# Altium project Smart-light.PrjPcb
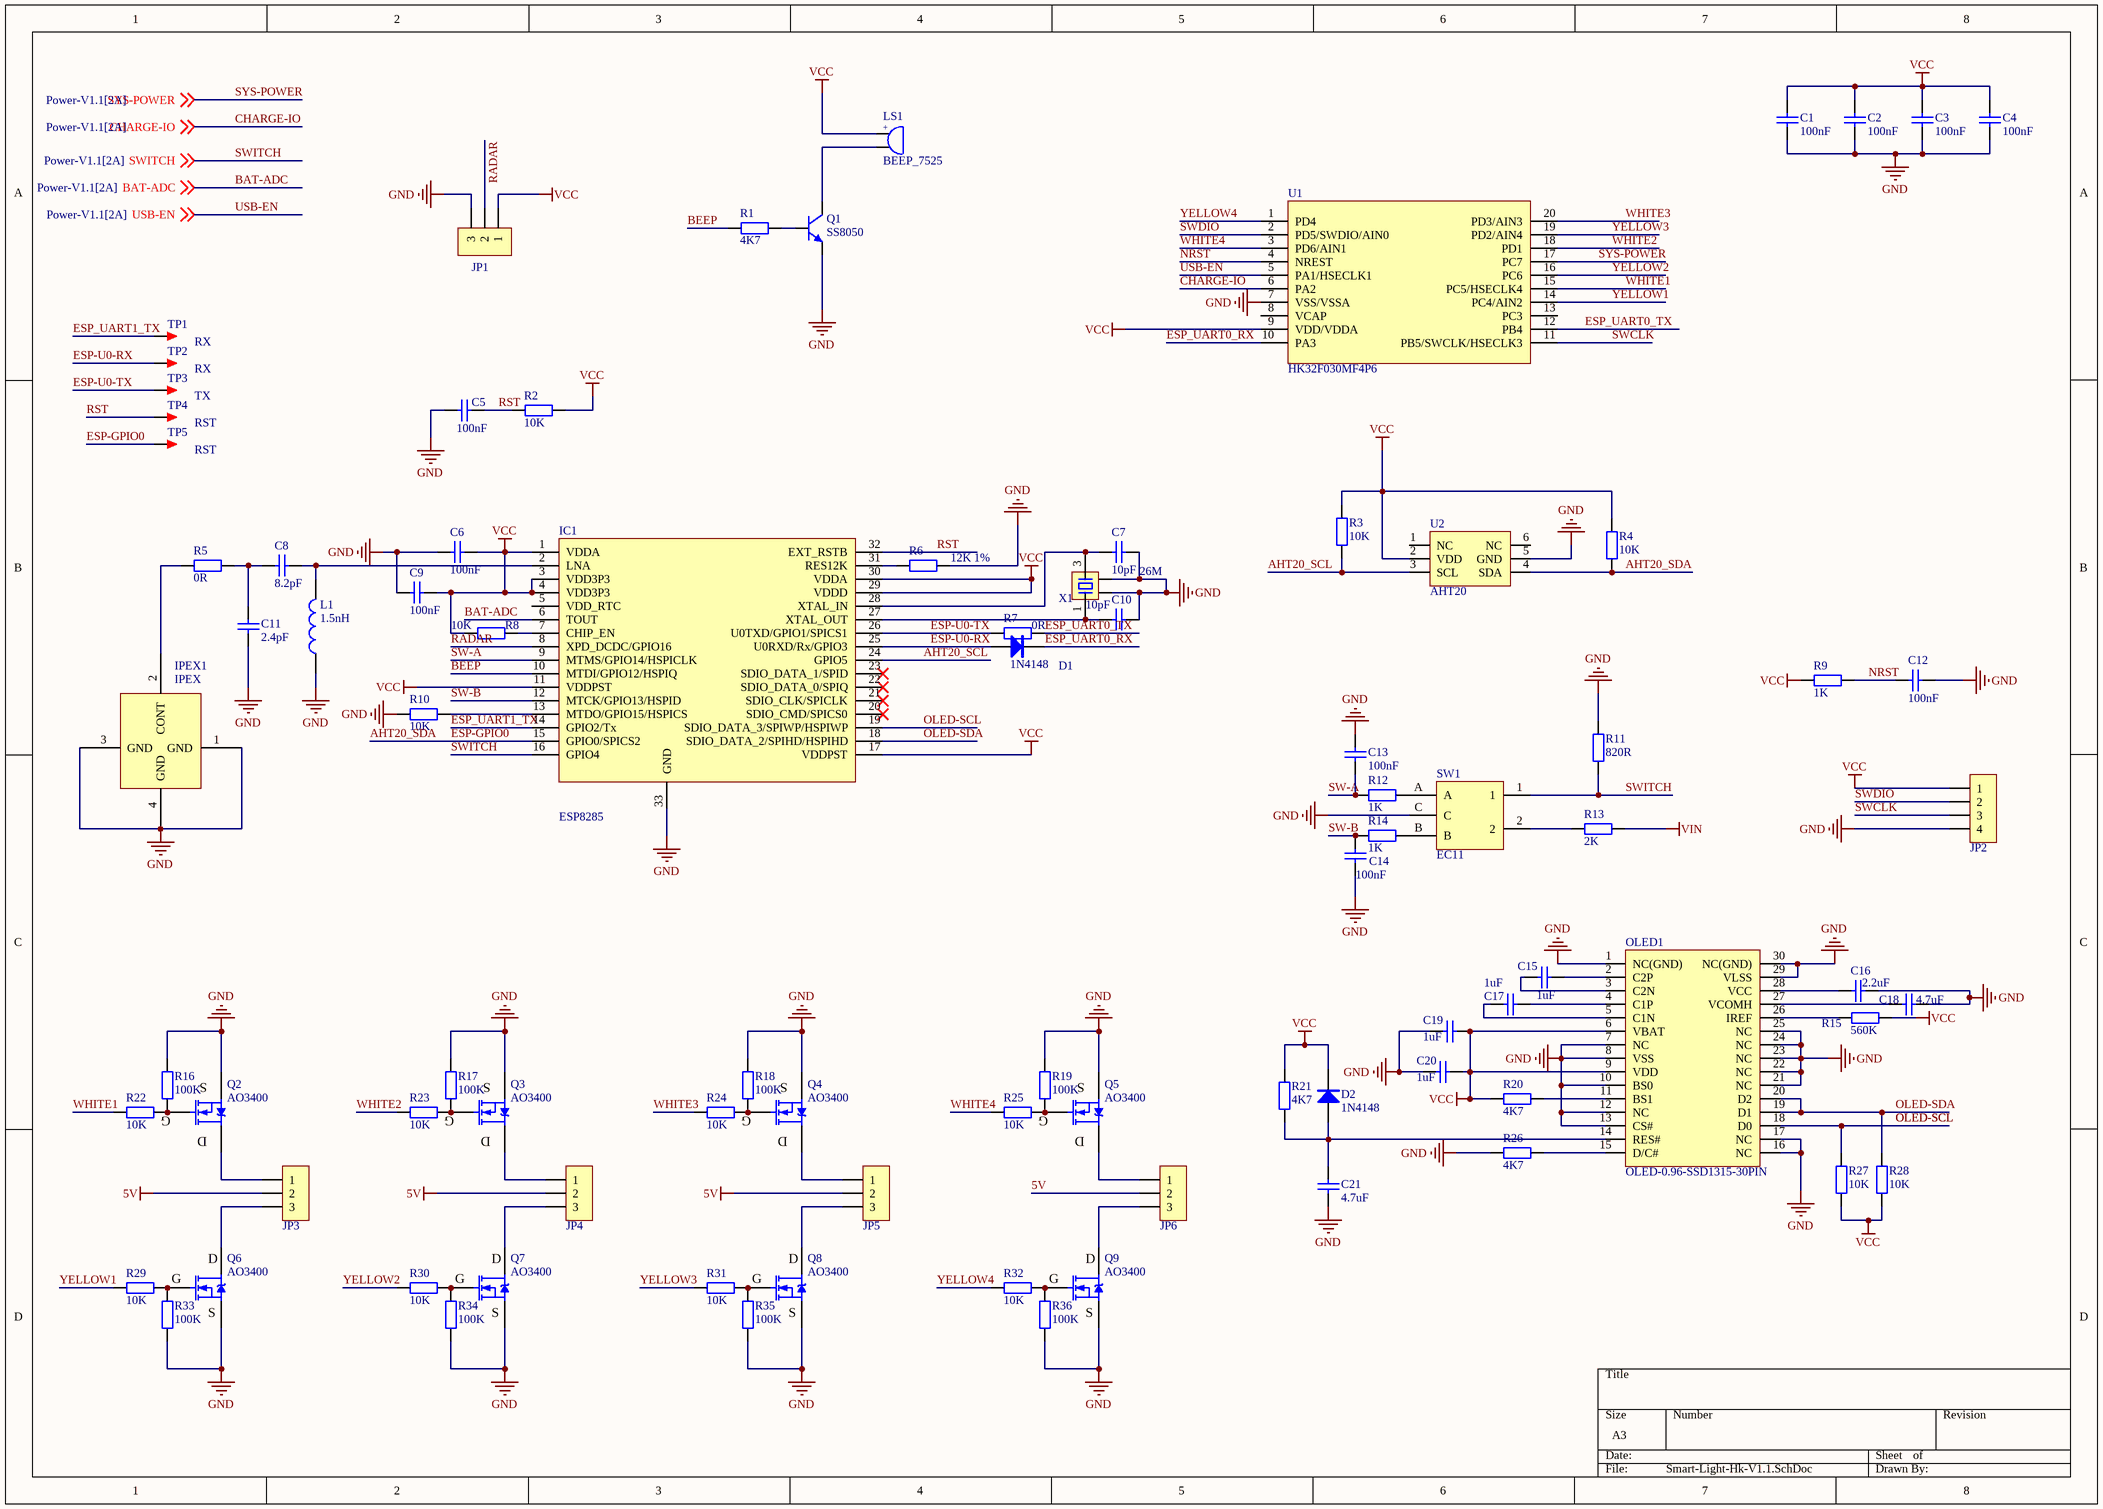
[diagram p0: Smart-Light-Hk-V1.1.SchDoc]
2 sheets, 137 parts. Net scope: global (net labels, ports and power ports of the same name join across sheets).
Board file: Smart-Light-Modulator-V1.1.PcbDoc
Sheets:
  Smart-Light-Hk-V1.1.SchDoc
  Power-V1.1.SchDoc

## Sheet Smart-Light-Hk-V1.1.SchDoc
size A3; SheetNumber: 1; SheetTotal: 2

### Parts
C1  100nF  [C0603_M]
C2  100nF  [C0603_M]
C3  100nF  [C0603_M]
C4  100nF  [C0603_M]
C5  100nF  [C0603_M]
C6  100nF  [C0603_M]
C7  10pF  [C0603_M]
C8  8.2pF  [C0603_M]
C9  100nF  [C0603_M]
C10  10pF  [C0603_M]
C11  2.4pF  [C0603_M]
C12  100nF  [C0603_M]
C13  100nF  [C0603_M]
C14  100nF  [C0603_M]
C15  1uF  [C0603_M]
C16  2.2uF  [C0603_M]
C17  1uF  [C0603_M]
C18  4.7uF  [C0603_M]
C19  1uF  [C0603_M]
C20  1uF  [C0603_M]
C21  4.7uF  [C0603_M]
D1  1N4148  [SOD-123]
D2  1N4148  [SOD-123]
IC1  ESP8285  [QFN32 5x5_N]
IPEX1  IPEX  [IPEX1_SMD]
JP1  HDR-1X3  [HDR2.54-WI-3P]  (value not drawn)
JP2  HDR-1X4  [HDR2.54-LI-4P]  (value not drawn)
JP3  HDR-1X3  [XH2.54-WI-3P]  (value not drawn)
JP4  HDR-1X3  [XH2.54-WI-3P]  (value not drawn)
JP5  HDR-1X3  [XH2.54-WI-3P]  (value not drawn)
JP6  HDR-1X3  [XH2.54-WI-3P]  (value not drawn)
L1  1.5nH  [L0603]
LS1  BEEP_7525  [BEEP 7525]
OLED1  OLED-0.96-SSD1315-30PIN  [SSD1306-30Pin]
Q1  SS8050  [SOT23-3N]
Q2  AO3400  [SOT23-3N]
Q3  AO3400  [SOT23-3N]
Q4  AO3400  [SOT23-3N]
Q5  AO3400  [SOT23-3N]
Q6  AO3400  [SOT23-3N]
Q7  AO3400  [SOT23-3N]
Q8  AO3400  [SOT23-3N]
Q9  AO3400  [SOT23-3N]
R1  4K7  [R0603_M]
R2  10K  [R0603_M]
R3  10K  [R0603_M]
R4  10K  [R0603_M]
R5  0R  [R0603_M]
R6  12K 1%  [R0603_M]
R7  0R  [R0603_M]
R8  10K  [R0603_M]
R9  1K  [R0603_M]
R10  10K  [R0603_M]
R11  820R  [R0603_M]
R12  1K  [R0603_M]
R13  2K  [R0603_M]
R14  1K  [R0603_M]
R15  560K  [R0603_M]
R16  100K  [R0603_M]
R17  100K  [R0603_M]
R18  100K  [R0603_M]
R19  100K  [R0603_M]
R20  4K7  [R0603_M]
R21  4K7  [R0603_M]
R22  10K  [R0603_M]
R23  10K  [R0603_M]
R24  10K  [R0603_M]
R25  10K  [R0603_M]
R26  4K7  [R0603_M]
R27  10K  [R0603_M]
R28  10K  [R0603_M]
R29  10K  [R0603_M]
R30  10K  [R0603_M]
R31  10K  [R0603_M]
R32  10K  [R0603_M]
R33  100K  [R0603_M]
R34  100K  [R0603_M]
R35  100K  [R0603_M]
R36  100K  [R0603_M]
SW1  EC11  [EC11-B]
TP1  RX  [TEST 1.6]
TP2  RX  [TEST 1.6]
TP3  TX  [TEST 1.6]
TP4  RST  [TEST 1.6]
TP5  RST  [TEST 1.6]
U1  HK32F030MF4P6  [TSSOP-20]
U2  AHT20  [AHT20]
X1  26M  [XTAL-3225-4P]

### Nets
5V: JP3.2 JP4.2 JP5.2 JP6.2
GND: C1.1 C2.1 C3.1 C4.1 C5.1 C6.1 C7.1 C9.1 C10.1 C11.1 C12.2 C13.2 C14.1 C16.2 C18.2 C19.1 C20.1 C21.2 IC1.33(GND) IPEX1.1(GND) IPEX1.3(GND) IPEX1.4(GND) JP1.3 JP2.4 L1.1 OLED1.1(NC(GND)) OLED1.7(NC) OLED1.8(VSS) OLED1.10(BS0) OLED1.12(NC) OLED1.13(CS#) OLED1.16(NC) OLED1.17(NC) OLED1.21(NC) OLED1.22(NC) OLED1.23(NC) OLED1.24(NC) OLED1.25(NC) OLED1.29(VLSS) OLED1.30(NC(GND)) Q1.2(E) Q2.2(S) Q3.2(S) Q4.2(S) Q5.2(S) Q6.2(S) Q7.2(S) Q8.2(S) Q9.2(S) R6.2 R10.2 R11.1 R16.1 R17.1 R18.1 R19.1 R26.2 R33.1 R34.1 R35.1 R36.1 SW1.C U1.7(VSS/VSSA) U2.5(GND) X1.2 X1.4
VCC: C1.2 C2.2 C3.2 C4.2 C6.2 C9.2 C19.2 C20.2 D2.2(K) IC1.1(VDDA) IC1.3(VDD3P3) IC1.4(VDD3P3) IC1.11(VDDPST) IC1.17(VDDPST) IC1.29(VDDD) IC1.30(VDDA) JP1.1 JP2.1 LS1.1 OLED1.6(VBAT) OLED1.9(VDD) R2.2 R3.2 R4.2 R8.2 R9.1 R15.1 R20.2 R21.1 R27.1 R28.1 U1.9(VDD/VDDA) U2.2(VDD)
VIN: R13.1
AHT20_SCL: IC1.24(GPIO5) R3.1 U2.3(SCL)
AHT20_SDA: IC1.15(GPIO0/SPICS2) R4.1 TP5.1 U2.4(SDA)  [also labelled ESP-GPIO0]
BAT-ADC: IC1.6(TOUT) ; off-sheet BAT-ADC
BEEP: IC1.10(MTDI/GPIO12/HSPIQ) R1.2
CHARGE-IO: U1.6(PA2) ; off-sheet CHARGE-IO
ESP-U0-RX: D1.1(A) IC1.25(U0RXD/Rx/GPIO3) TP2.1
ESP-U0-TX: IC1.26(U0TXD/GPIO1/SPICS1) R7.2 TP3.1
ESP_UART0_RX: D1.2(K) U1.10(PA3)
ESP_UART0_TX: R7.1 U1.12(PB4)
ESP_UART1_TX: IC1.14(GPIO2/Tx) TP1.1
NRST: C12.1 R9.2 U1.4(NREST)
OLED-SCL: IC1.19(SDIO_DATA_3/SPIWP/HSPIWP) OLED1.18(D0) R27.2
OLED-SDA: IC1.18(SDIO_DATA_2/SPIHD/HSPIHD) OLED1.19(D1) OLED1.20(D2) R28.2
RADAR: IC1.8(XPD_DCDC/GPIO16) JP1.2
RST: C5.2 IC1.32(EXT_RSTB) R2.1 TP4.1
SW-A: C13.1 IC1.9(MTMS/GPIO14/HSPICLK) R12.1
SW-B: C14.2 IC1.12(MTCK/GPIO13/HSPID) R14.1
SWCLK: JP2.3 U1.11(PB5/SWCLK/HSECLK3)
SWDIO: JP2.2 U1.2(PD5/SWDIO/AIN0)
SWITCH: IC1.16(GPIO4) R11.2 SW1.1 ; off-sheet SWITCH
SYS-POWER: U1.17(PC7) ; off-sheet SYS-POWER
USB-EN: U1.5(PA1/HSECLK1) ; off-sheet USB-EN
WHITE1: R22.1 U1.15(PC5/HSECLK4)
WHITE2: R23.1 U1.18(PD1)
WHITE3: R24.1 U1.20(PD3/AIN3)
WHITE4: R25.1 U1.3(PD6/AIN1)
YELLOW1: R29.1 U1.14(PC4/AIN2)
YELLOW2: R30.1 U1.16(PC6)
YELLOW3: R31.1 U1.19(PD2/AIN4)
YELLOW4: R32.1 U1.1(PD4)
NetC7_2: C7.2 IC1.28(XTAL_IN) X1.3
NetC8_1: C8.1 IC1.2(LNA) L1.2
NetC8_2: C8.2 C11.2 R5.2
NetC10_2: C10.2 IC1.27(XTAL_OUT) X1.1
NetC15_1: C15.1 OLED1.3(C2N)
NetC15_2: C15.2 OLED1.2(C2P)
NetC16_1: C16.1 OLED1.28(VCC)
NetC17_1: C17.1 OLED1.5(C1N)
NetC17_2: C17.2 OLED1.4(C1P)
NetC18_1: C18.1 OLED1.27(VCOMH)
NetC21_1: C21.1 D2.1(A) OLED1.14(RES#) R21.2
NetIC1_7: IC1.7(CHIP_EN) R8.1
NetIC1_13: IC1.13(MTDO/GPIO15/HSPICS) R10.1
NetIC1_31: IC1.31(RES12K) R6.1
NetIPEX1_2: IPEX1.2(CONT) R5.1
NetJP3_1: JP3.1 Q2.3(D)
NetJP3_3: JP3.3 Q6.3(D)
NetJP4_1: JP4.1 Q3.3(D)
NetJP4_3: JP4.3 Q7.3(D)
NetJP5_1: JP5.1 Q4.3(D)
NetJP5_3: JP5.3 Q8.3(D)
NetJP6_1: JP6.1 Q5.3(D)
NetJP6_3: JP6.3 Q9.3(D)
NetLS1_2: LS1.2 Q1.3(C)
NetOLED1_11: OLED1.11(BS1) R20.1
NetOLED1_15: OLED1.15(D/C#) R26.1
NetOLED1_26: OLED1.26(IREF) R15.2
NetQ1_1: Q1.1(B) R1.1
NetQ2_1: Q2.1(G) R16.2 R22.2
NetQ3_1: Q3.1(G) R17.2 R23.2
NetQ4_1: Q4.1(G) R18.2 R24.2
NetQ5_1: Q5.1(G) R19.2 R25.2
NetQ6_1: Q6.1(G) R29.2 R33.2
NetQ7_1: Q7.1(G) R30.2 R34.2
NetQ8_1: Q8.1(G) R31.2 R35.2
NetQ9_1: Q9.1(G) R32.2 R36.2
NetR12_2: R12.2 SW1.A
NetR13_2: R13.2 SW1.2
NetR14_2: R14.2 SW1.B

Not connected (* = marked no-connect by the designer): IC1 5(VDD_RTC) 20(SDIO_CMD/SPICS0)* 21(SDIO_CLK/SPICLK)* 22(SDIO_DATA_0/SPIQ)* 23(SDIO_DATA_1/SPID)*; LS1 3 4; U1 8(VCAP) 13(PC3); U2 1(NC) 6(NC)

### Notes on the sheet
- (in symbol BEEP_7525) +

### Library data of the parts
C1-C21 = C: 贴片电容/MLCC电容; BOM名称: 无极性贴片电容; 联系下单店铺卖家 免费帮你查找封装: 联系下单店铺卖家 免费技术支持
D1 D2 = 1N4148: 开关二极管; BOM名称: 高速开关二极管; 以赠品形式获赠本封装库的买家，还可联系卖家免费指导AD软件使用: 封装库来自淘宝卖家ID：黄晶宝石
IC1 = ESP8285: WIFI-芯片 内置Flash; 联系下单店铺卖家 免费帮你查找封装: 唯一出售店铺网址https://shop463601444.taobao.com; BOM名称: WIFI-芯片
IPEX1 = IPEX: IPEX天线母座
JP1 JP3-JP6 = Header 3: 3P接插件; 联系卖家，免费查找封装: 唯一出售店铺网址https://shop463601444.taobao.com; 封装库来自淘宝卖家ID：黄晶宝石: 其他店铺购入均为盗版封装库，请立即申请退款，本店现金奖励50~200元; BOM名称: 3P接插件
JP2 = Header 4: 4P接插件; 联系卖家，免费查找封装: 唯一出售店铺网址https://shop463601444.taobao.com; 封装库来自淘宝卖家ID：黄晶宝石: 其他店铺购入均为盗版封装库，请立即申请退款，本店现金奖励50~200元; BOM名称: 4P接插件
L1 = L: 贴片小功率电感; BOM名称: 小功率贴片电感; 联系下单店铺卖家 免费帮你查找封装: 联系下单店铺卖家 免费技术支持
LS1 = BEEP_7525: 无源蜂鸣器侧发声
Q1 = 8050-SMD: 高频放大-NPN型; 参数: 40V 1.5A 1W 100MHZ; 8元以下特价购入的买家: 还可以联系卖家远程指导AD软件使用; BOM名称: 高频放大-NPN型
Q2-Q9 = AO3400: N沟道 30V/4.2A; BOM名称: 场效应管; 8元以下特价购入的买家: 还可以联系卖家远程指导AD软件使用; 参数: N沟道 30V/4.2A
R1-R36 = R: 贴片电阻; 联系下单店铺卖家 免费帮你查找封装: 联系下单店铺卖家 免费技术支持; BOM名称: 贴片电阻
SW1 = EC11: 数字开关编码器; BOM名称: 数字编码开关; 联系卖家，免费查找封装: 唯一出售店铺网址https://shop463601444.taobao.com; 封装库来自淘宝卖家：黄晶宝石: 其他店铺购入均为盗版封装库，请立即申请退款，本店现金奖励200~1000元
TP1-TP5 = TEST: 测试点; 联系卖家，免费查找封装: 唯一出售店铺网址https://shop463601444.taobao.com; 封装库来自淘宝卖家：黄晶宝石: 其他店铺购入均为盗版封装库，请立即申请退款，本店现金奖励200~1000元; BOM名称: 测试点
U1 = HK32F030MF4P6: HK32F030M 系列使用 ARM® CortexTM-M0 内核，最高工作频率 32MHz，内置 16K-Byte / FLASH、448-Byte EEPROM 和 2-KByte SRAM。通过 FLASH 控制器的寄存器配置，可实 / 现中断向量在 16K-Byte 空间内的重映射。
U2 = AHT20: IIC接口 温湿度传感器
X1 = XTAL-4P: 4脚无源晶振(谐振器）; 联系下单店铺卖家 免费帮你查找封装: 联系下单店铺卖家 免费技术支持; BOM名称: 4脚无源晶振(谐振器）

## Sheet Power-V1.1.SchDoc
size A3; SheetNumber: 2; SheetTotal: 2
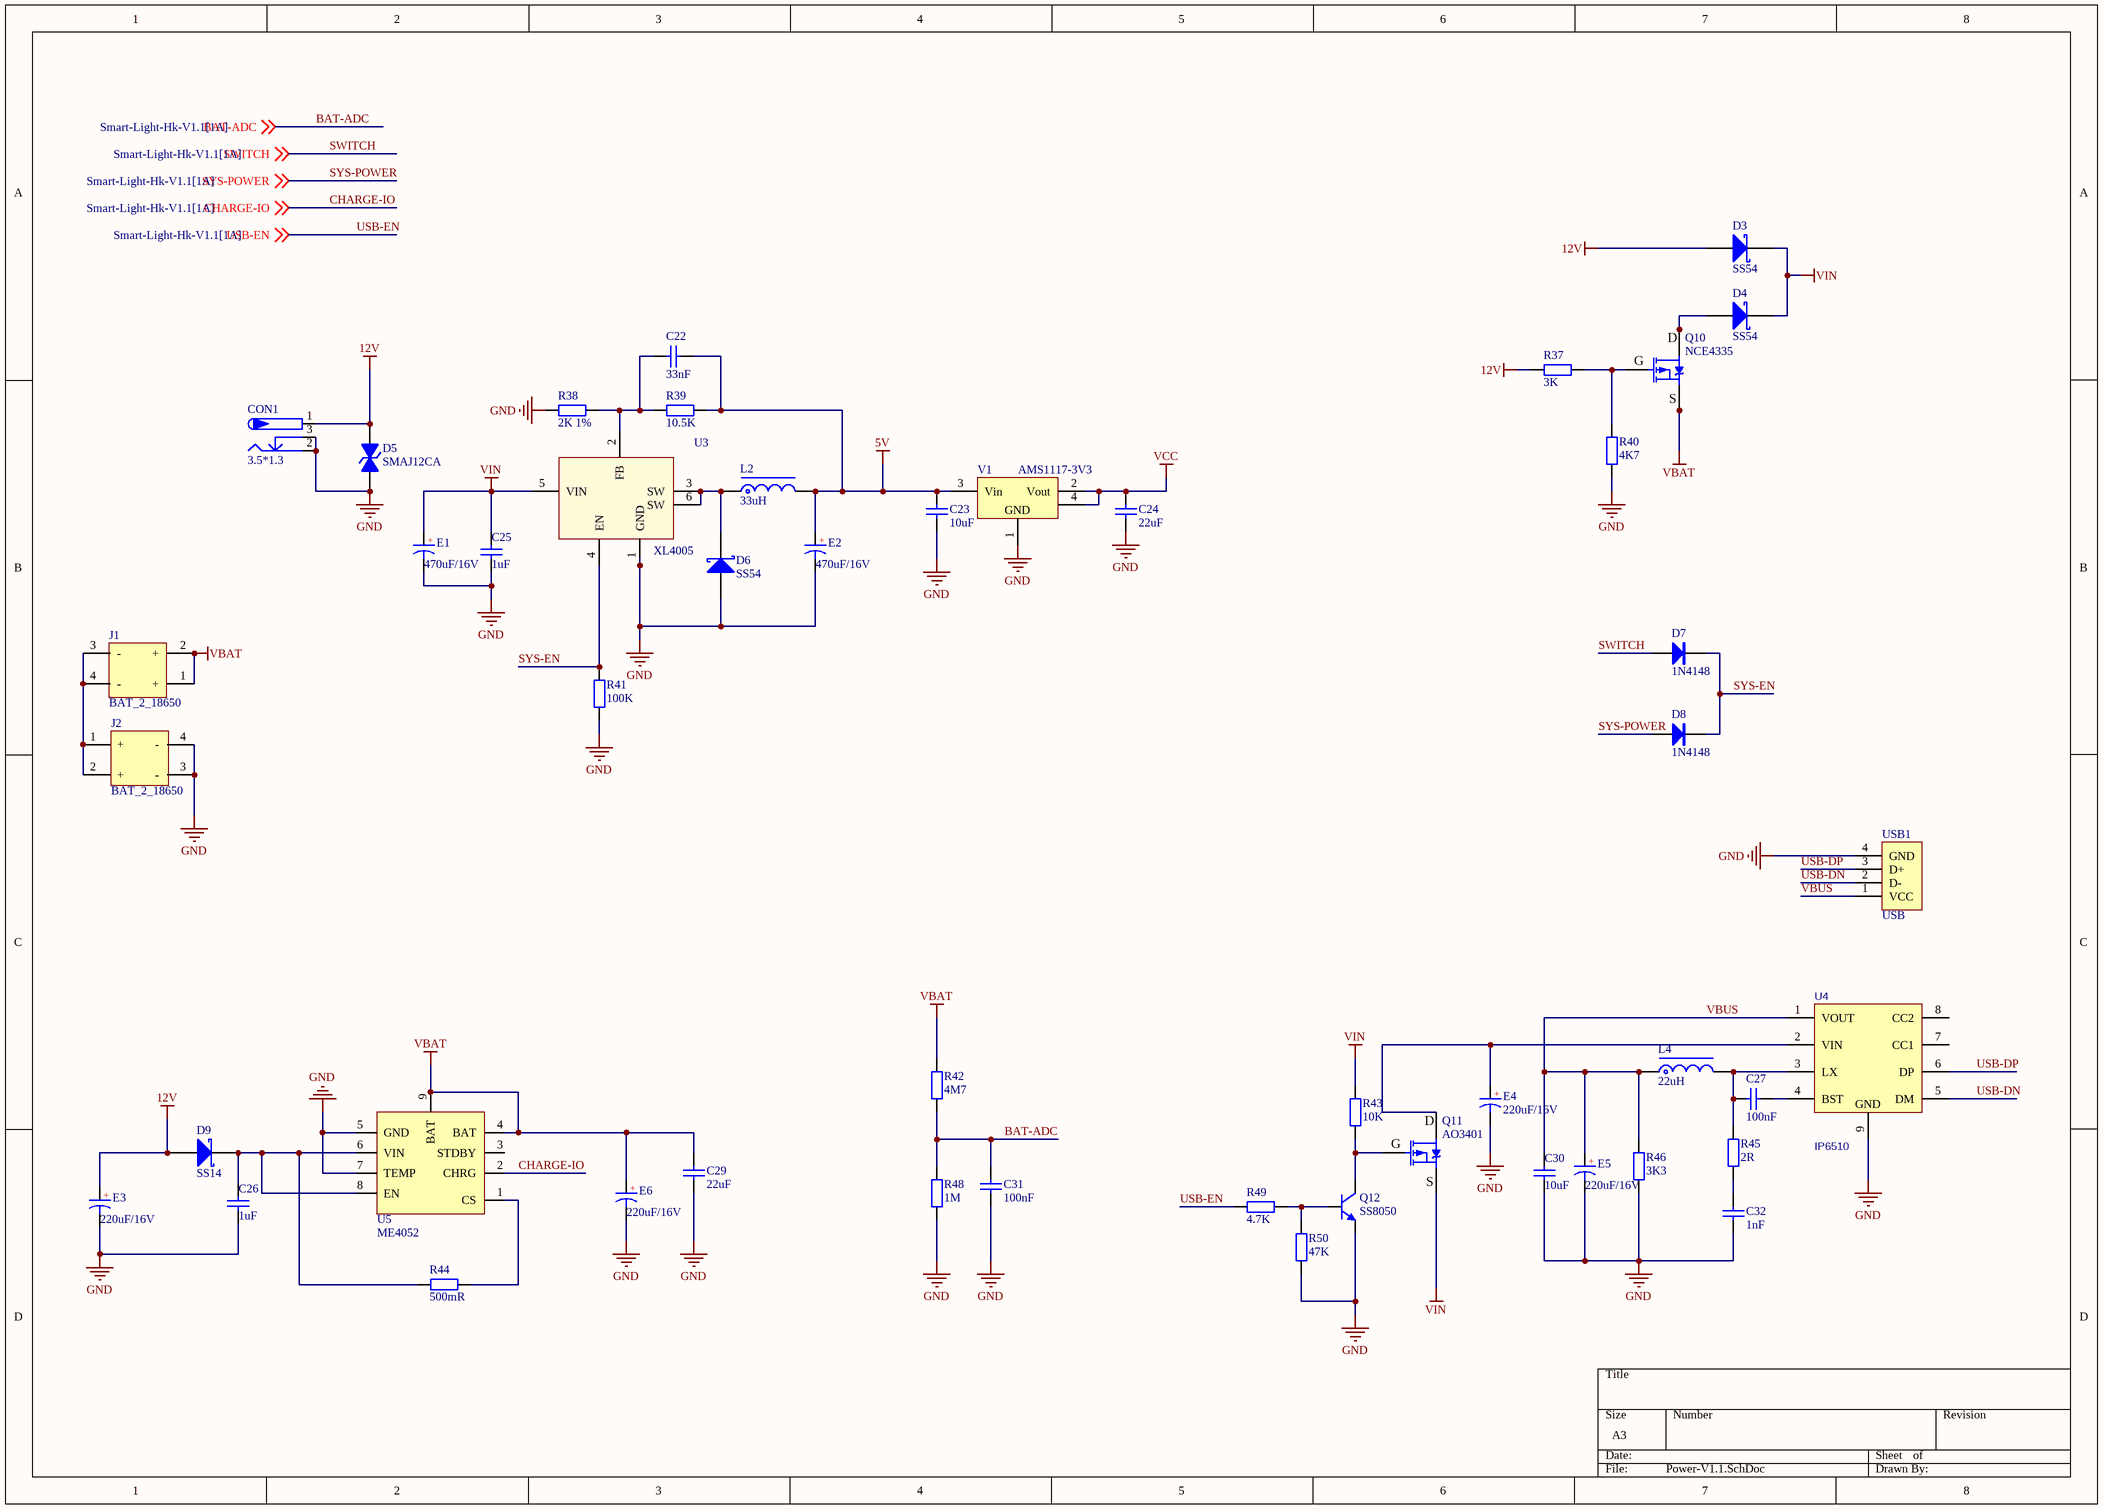
[diagram p1: Power-V1.1.SchDoc]

### Parts
C22  33nF  [C0603_M]
C23  10uF  [C0603_M]
C24  22uF  [C1206_M]
C25  1uF  [C0805_L]
C26  1uF  [C0805_L]
C27  100nF  [C0603_M]
C29  22uF  [C1206_M]
C30  10uF  [C1206_M]
C31  100nF  [C0603_M]
C32  1nF  [C0603_M]
CON1  3.5*1.3  [DC-005]
D3  SS54  [SMA]
D4  SS54  [SMA]
D5  SMAJ12CA  [SMA]
D6  SS54  [SMA]
D7  1N4148  [SOD-123]
D8  1N4148  [SOD-123]
D9  SS14  [SMA]
E1  470uF/16V  [CE E(8*10.2)]
E2  470uF/16V  [CE E(8*10.2)]
E3  220uF/16V  [CE D(6.3*7.7)]
E4  220uF/16V  [CE D(6.3*7.7)]
E5  220uF/16V  [CE D(6.3*7.7)]
E6  220uF/16V  [CE D(6.3*7.7)]
J1  BAT_2_18650  [BAT_2_18650]
J2  BAT_2_18650  [BAT_2_18650]
L2  33uH  [L-SMD-1265]
L4  22uH  [CDRH125]
Q10  NCE4335  [SOP-8]
Q11  AO3401  [SOT23-3N]
Q12  SS8050  [SOT23-3N]
R37  3K  [R0603_M]
R38  2K 1%  [R0603_M]
R39  10.5K  [R0603_M]
R40  4K7  [R0603_M]
R41  100K  [R0603_M]
R42  4M7  [R0603_M]
R43  10K  [R0603_M]
R44  500mR  [R1206_L]
R45  2R  [R0603_M]
R46  3K3  [R0603_M]
R48  1M  [R0603_M]
R49  4.7K  [R0603_M]
R50  47K  [R0603_M]
U3  XL4005  [TO263-5A]
U4  IP6510  [ESOP8_M]
U5  ME4052  [ESOP8_M]
USB1  USB  [USB2.0_Type-A_SMD_F_2]
V1  AMS1117-3V3  [SOT223_L]

### Nets
5V: C22.2 C23.2 E2.1 L2.2 R39.2 V1.3(Vin)
12V: CON1.1 D3.1(A) D5.2(K) D9.1(A) E3.1 R37.2
GND: C23.1 C24.1 C25.1 C26.1 C29.1 C30.1 C31.1 C32.2 CON1.2 CON1.3 D5.1(A) D6.1(A) E1.2 E2.2 E3.2 E4.2 E5.2 E6.2 J2.3(-) J2.4(-) Q12.2(E) R38.1 R40.1 R41.1 R46.2 R48.1 R50.2 U3.1(GND) U4.9(GND) U5.5(GND) U5.7(TEMP) USB1.4(GND) V1.1(GND)
VBAT: C29.2 E6.1 J1.1(+) J1.2(+) Q10.1(S) Q10.2(S) Q10.3(S) R42.2 U5.4(BAT) U5.9(BAT)
VCC: C24.2 V1.2(Vout) V1.4(GND)
VIN: C25.2 D3.2(K) D4.2(K) E1.1 Q11.2(S) R43.2 U3.5(VIN)
BAT-ADC: C31.2 R42.1 R48.2 ; off-sheet BAT-ADC
CHARGE-IO: U5.2(CHRG) ; off-sheet CHARGE-IO
SWITCH: D7.1(A) ; off-sheet SWITCH
SYS-EN: D7.2(K) D8.2(K) R41.2 U3.4(EN)
SYS-POWER: D8.1(A) ; off-sheet SYS-POWER
USB-DN: U4.5(DM) USB1.2(D-)
USB-DP: U4.6(DP) USB1.3(D+)
USB-EN: R49.2 ; off-sheet USB-EN
VBUS: C30.2 E5.1 L4.1 R46.1 U4.1(VOUT) USB1.1(VCC)
NetC22_1: C22.1 R38.2 R39.1 U3.2(FB)
NetC26_2: C26.2 D9.2(K) R44.1 U5.6(VIN) U5.8(EN)
NetC27_1: C27.1 U4.4(BST)
NetC27_2: C27.2 L4.2 R45.2 U4.3(LX)
NetC32_1: C32.1 R45.1
NetD4_1: D4.1(A) Q10.5(D) Q10.6(D) Q10.7(D) Q10.8(D)
NetD6_2: D6.2(K) L2.1 U3.3(SW) U3.6(SW)
NetE4_1: E4.1 Q11.3(D) U4.2(VIN)
NetJ1_3: J1.3(-) J1.4(-) J2.1(+) J2.2(+)
NetQ10_4: Q10.4(G) R37.1 R40.2
NetQ11_1: Q11.1(G) Q12.3(C) R43.1
NetQ12_1: Q12.1(B) R49.1 R50.1
NetR44_2: R44.2 U5.1(CS)

Not connected (* = marked no-connect by the designer): U4 7(CC1) 8(CC2); U5 3(STDBY)

### Notes on the sheet
- (in symbol CE_SMD) +

### Library data of the parts
C22-C27 C29-C32 = C: as C1 on sheet Smart-Light-Hk-V1.1
CON1 = DC002~DC005: 低压电源接口; BOM名称: DC电源接口; 联系下单店铺卖家 免费帮你查找封装: 封装库来自淘宝卖家ID：黄晶宝石
D3 D4 D6 = SS54: 肖特基二极管; 属性: 40V/5A; 以赠品形式获赠本封装库的买家，还可联系卖家免费指导AD软件使用: 封装库来自淘宝卖家ID：黄晶宝石; BOM名称: 肖特基二极管
D5 = SMAJ12CA: 双向TVS VRWM 12V
D7 D8 = 1N4148: as D1 on sheet Smart-Light-Hk-V1.1
D9 = SS14: 肖特基二极管; 属性: 40V/1A; 以赠品形式获赠本封装库的买家，还可联系卖家免费指导AD软件使用: 封装库来自淘宝卖家ID：黄晶宝石; BOM名称: 肖特基二极管
E1-E6 = CE_SMD: 贴片电解电容; 联系下单店铺卖家 免费帮你查找封装: 联系下单店铺卖家 免费技术支持; BOM名称: 贴片电解电容
J1 J2 = BAT_2_18650: 18650电池盒
L2 = L-Molding Choke: 一体成型电感; 联系下单店铺卖家 免费帮你查找封装: 联系下单店铺卖家 免费技术支持; BOM名称: 一体成型电感
L4 = L-CDRH: CDRH功率屏蔽电感; BOM名称: 功率屏蔽电感; 联系下单店铺卖家 免费帮你查找封装: 联系下单店铺卖家 免费技术支持
Q10 = NCE4335: P沟道 -30V/-9A; BOM名称: P沟道场效应管; 8元以下特价购入的买家: 还可以联系卖家 远程指导AD软件使用
Q11 = AO3401: P沟道 30V/4.2A; BOM名称: 场效应管; 8元以下特价购入的买家: 还可以联系卖家远程指导AD软件使用; 参数: P沟道 30V/4.2A
Q12 = 8050-SMD: as Q1 on sheet Smart-Light-Hk-V1.1; BOM名称: 高频放大-NPN型
R37-R46 R48-R50 = R: 贴片电阻; 联系下单店铺卖家 免费帮你查找封装: 联系下单店铺卖家 免费技术支持; BOM名称: 贴片电阻
U3 = XL4005: 降压芯片5A   xl4003 4A; 封装库来自淘宝卖家：黄晶宝石: 其他店铺购入的买家，请立即申请退款，本店现金奖励200~1000元
U4 = IP6510: 快充芯片; 封装库来自淘宝卖家：黄晶宝石: 其他店铺购入的买家，请立即申请退款，本店现金奖励200~1000元
U5 = ME4052: 两节锂电池充电芯片
USB1 = USB2.0_Type-A_F: USB2.0_Type-A母座; 联系下单店铺卖家 免费帮你查找封装: 封装库来自淘宝卖家ID：黄晶宝石; BOM名称: USB2.0_Type-A母座
V1 = AMS1117: 三端稳压芯片; BOM名称: 稳压芯片; 封装库来自淘宝卖家：黄晶宝石: 其他店铺购入的买家，请立即申请退款，本店现金奖励200~1000元

## Nets that join several sheets
5V: Smart-Light-Hk-V1.1 (JP3.2 JP4.2 JP5.2 JP6.2), Power-V1.1 (6 pins)
GND: Smart-Light-Hk-V1.1 (66 pins), Power-V1.1 (33 pins)
VCC: Smart-Light-Hk-V1.1 (33 pins), Power-V1.1 (C24.2 V1.2 V1.4)
VIN: Smart-Light-Hk-V1.1 (R13.1), Power-V1.1 (7 pins)
BAT-ADC: Smart-Light-Hk-V1.1 (IC1.6), Power-V1.1 (C31.2 R42.1 R48.2)
CHARGE-IO: Smart-Light-Hk-V1.1 (U1.6), Power-V1.1 (U5.2)
SWITCH: Smart-Light-Hk-V1.1 (IC1.16 R11.2 SW1.1), Power-V1.1 (D7.1)
SYS-POWER: Smart-Light-Hk-V1.1 (U1.17), Power-V1.1 (D8.1)
USB-EN: Smart-Light-Hk-V1.1 (U1.5), Power-V1.1 (R49.2)